# EAGLE board RFboardLeiden48_V_1.00 (EAGLE 7.7.0), part 1 of 2
AUTHOR: Kirchschlager Raimund
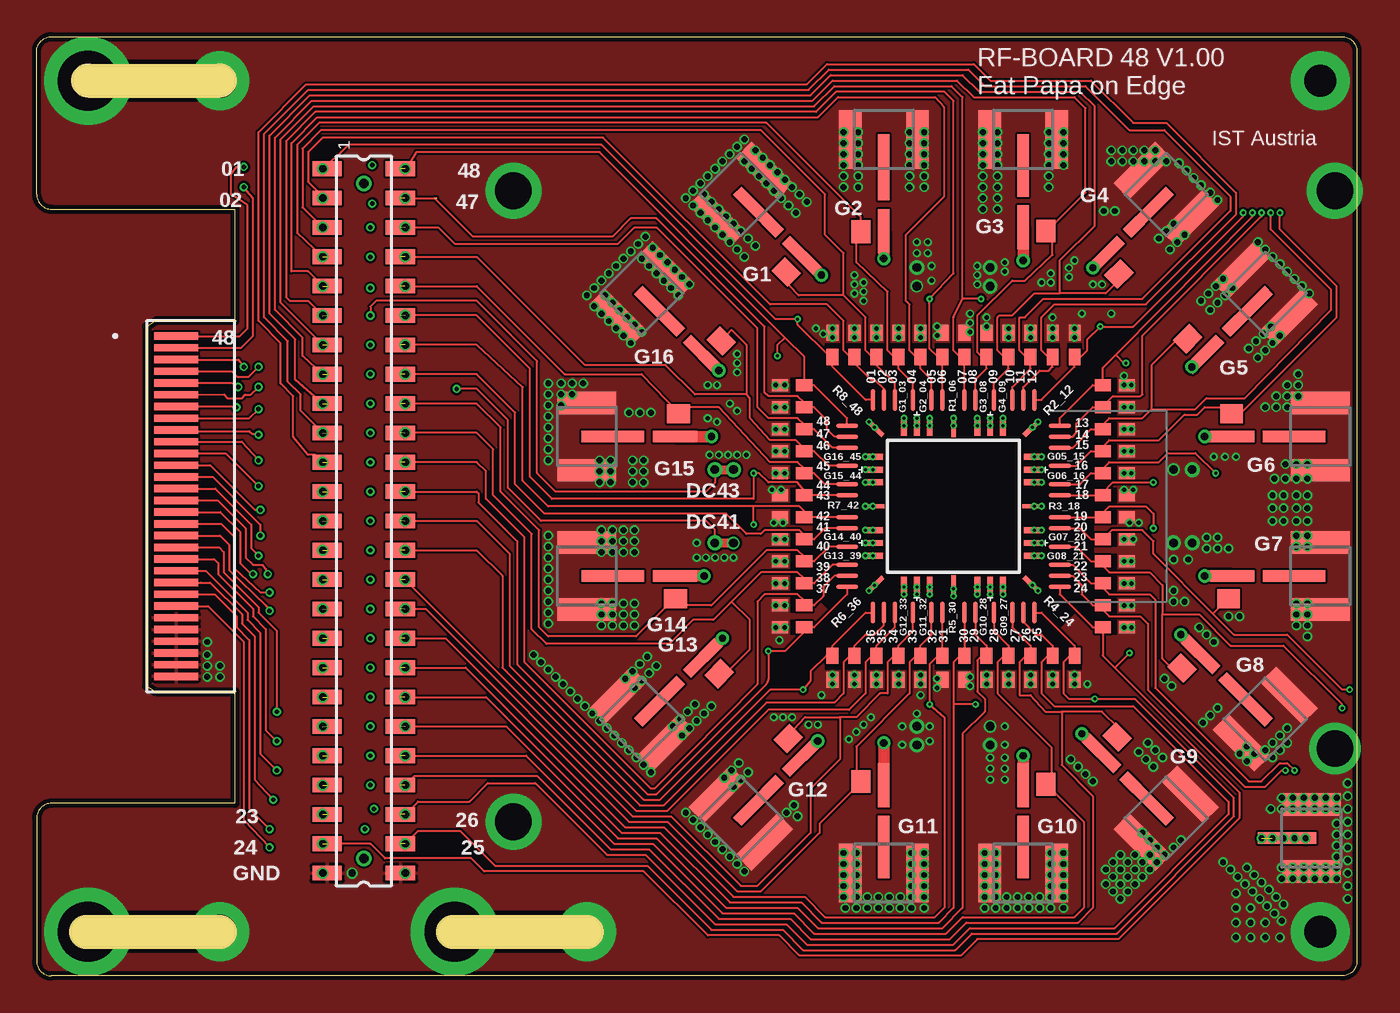
[diagram p5: board, top side]
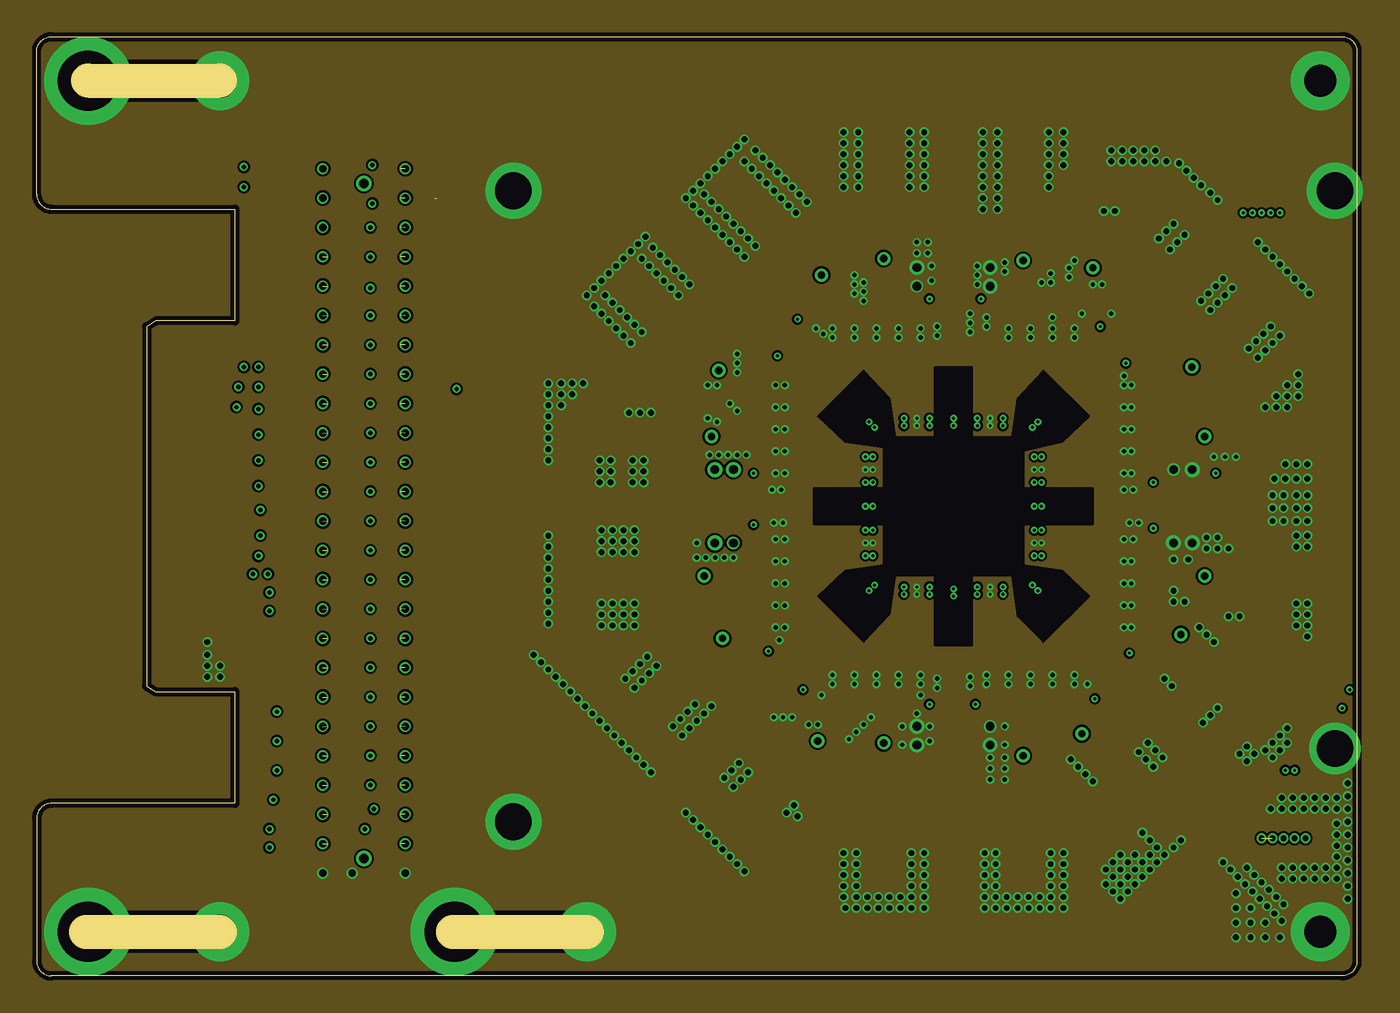
[diagram p6: board, inner layer GND1]
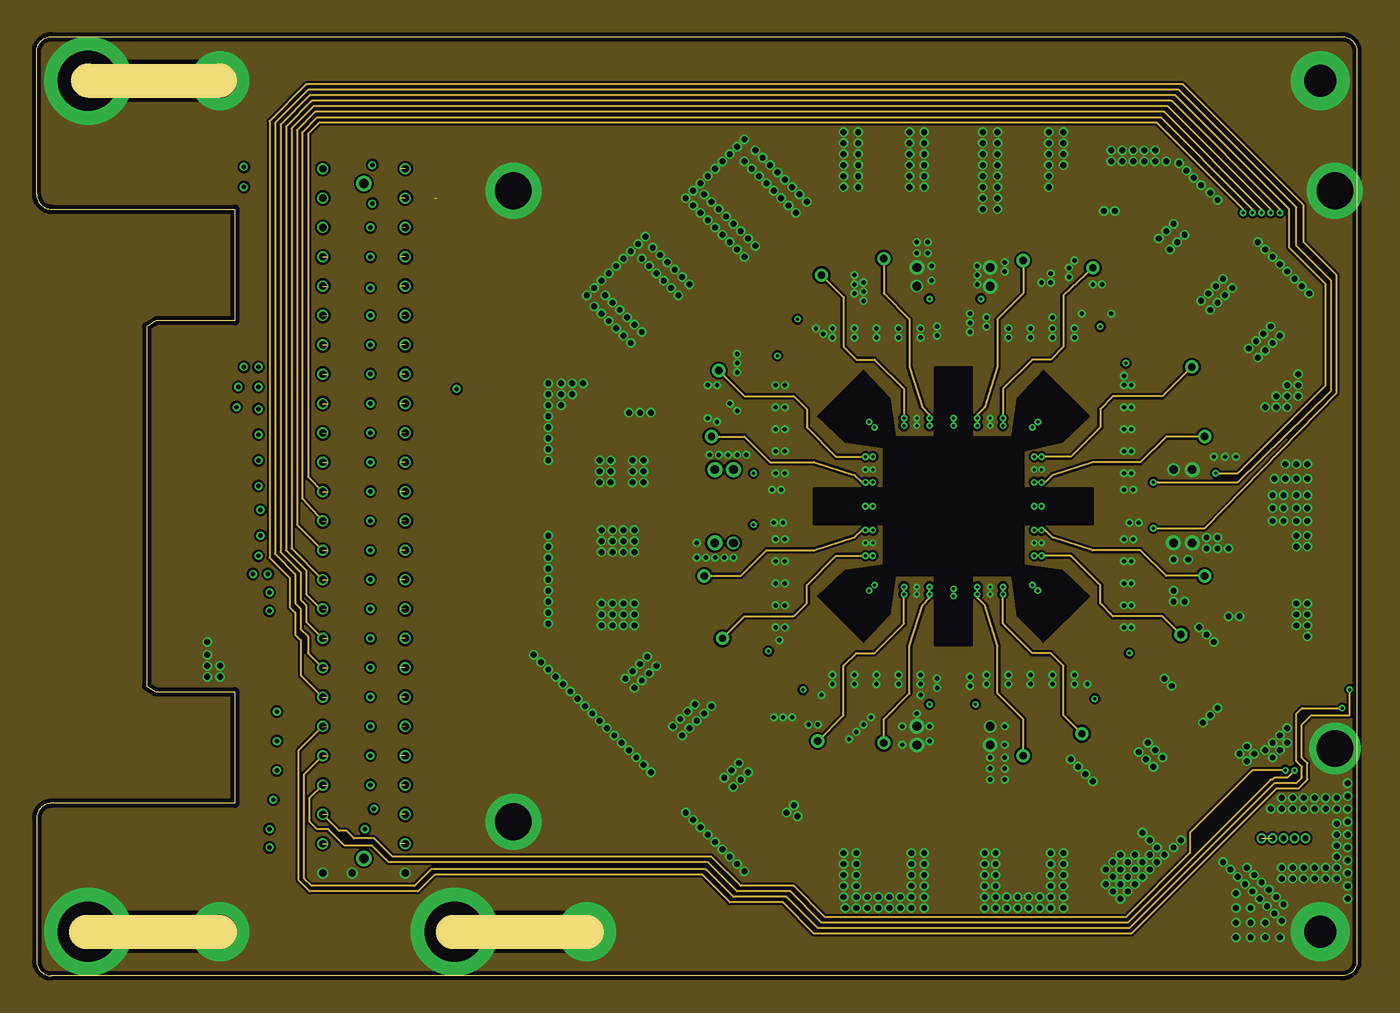
[diagram p7: board, inner layer FAST_GATES]
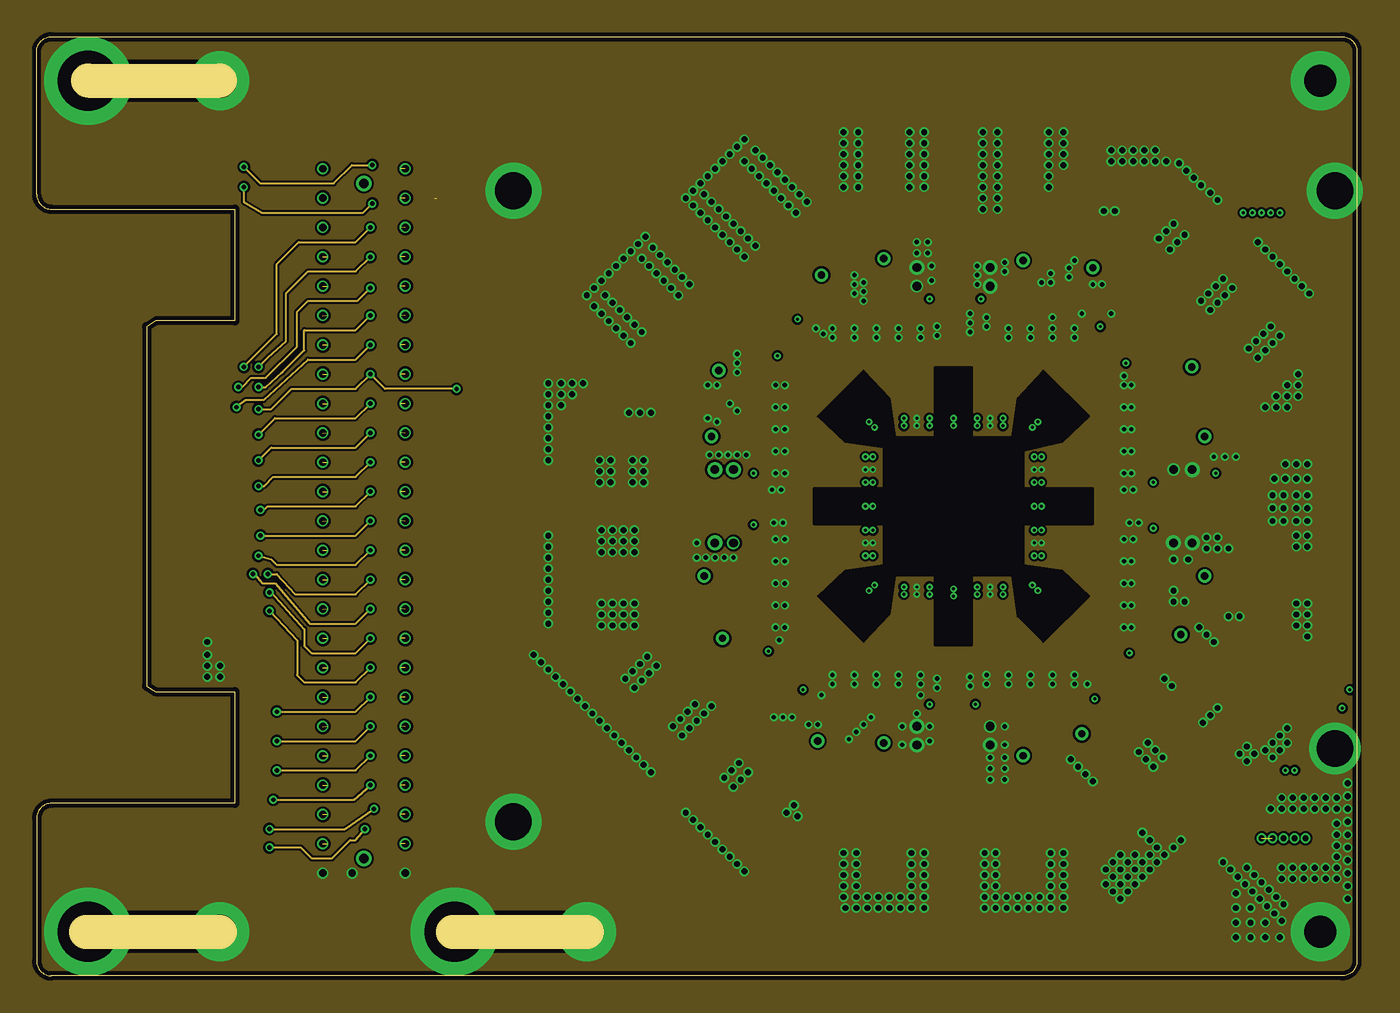
[diagram p8: board, inner layer GND2]
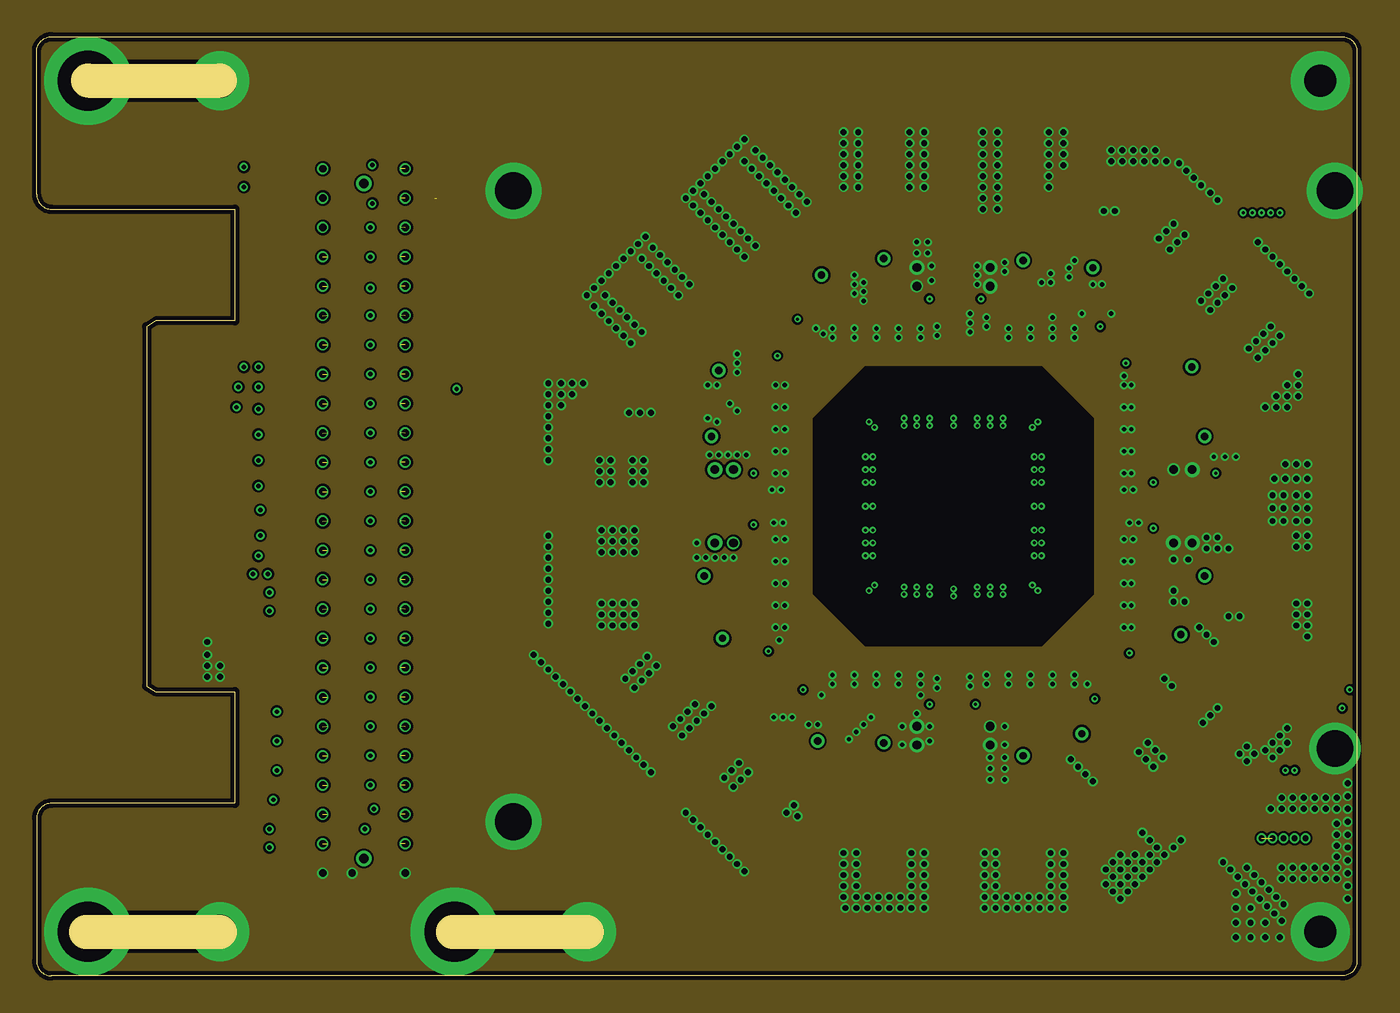
[diagram p9: board, inner layer GND_REFLECTOMETRY]
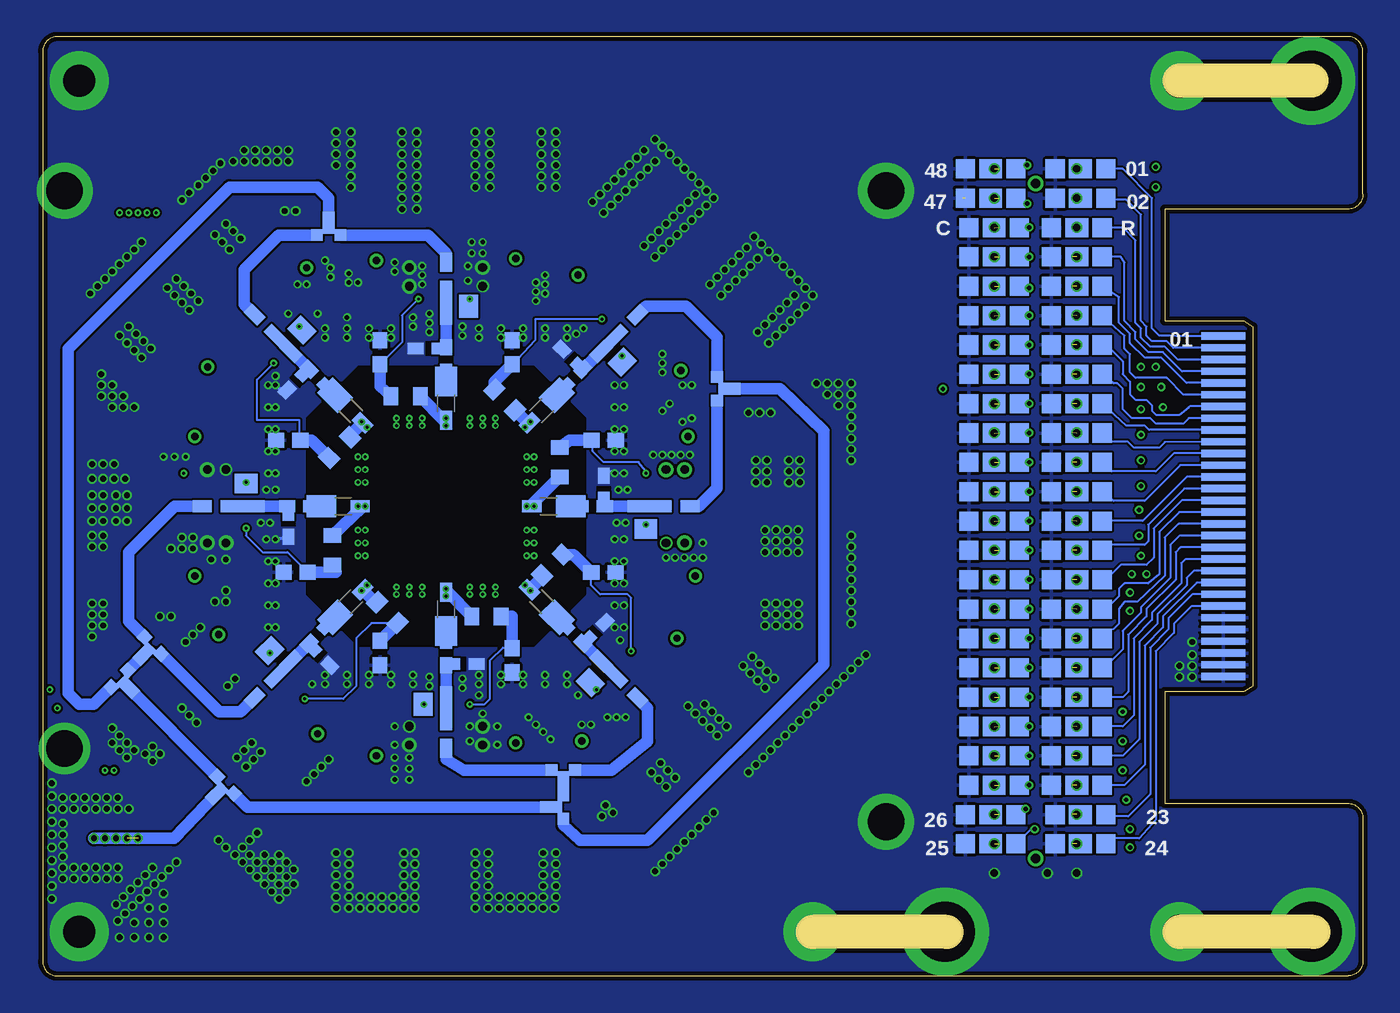
[diagram p10: board, bottom side, seen from below]

Size 90 x 64 mm. Coordinates in mm from the lower left corner, seen from the top.
Outline: 3.38,3 12.5,3
Outline: 3.5,61 12.5,61
Outline: 28.38,3 37.5,3
Outline: 0,53.25 0,63 arc-90 1,64 89,64 arc-90 90,63 90,1 arc-90 89,0 1,0 arc-90 0,1 0,10.75 arc-90 1,11.75 13.5,11.75 13.5,19.38 8.12,19.38 7.5,19.75 7.5,44.25 8.12,44.62 13.5,44.62 13.5,52.25 1,52.25 arc-90 0,53.25
Copper layers (1+2+3*14+15+16): TOP 0.035mm / dielectric 0.4mm / GND1 0.035mm / dielectric 0.2mm / FAST_GATES 0.035mm / dielectric 0.2mm / GND2 0.035mm / dielectric 0.2mm / GND_REFLECTOMETRY 0.035mm / dielectric 0.4mm / REFLECTOMETRY 0.035mm
Design rules "PCB-POOL HighSpec_ML6+ *": minimum track width 0.125mm, minimum drill 0.2mm, track to track 0.125mm, track to pad 0.125mm, pad to pad 0.125mm, via to via 0.125mm, smd to smd 0.125mm, copper to edge 0.3mm, drill to drill 0.2mm, minimum pad ring 0.2mm, minimum via ring 0.125mm, stop-mask expansion 0.065mm, vias tented up to drill 0.4mm, thermal gap 0.2mm
Net classes: 0 GND: clearance 0.15 mm; 1 HF: width 0.15 mm, clearance 0.25 mm; 2 REFL: width 0.8 mm, clearance 0.8 mm

## Footprints (pad centres in the part's own frame; a part is rotated, then mirrored left to right if it is on the bottom)
BIAS_TEE_UP_0603 = smd 1.3 x 0.8: HF 3.25,0 | smd 1.55 x 1.3: LF 0.25,-1.55 | smd 3 x 0.8: OUT 0.5,0
BIAS_TEE_DOWN_0603 = smd 1.3 x 0.8: HF 3.25,0 | smd 1.55 x 1.3: LF 0.45,1.55 | smd 3 x 0.8: OUT 0.5,0
SAMTEC_MEC8-130-XX-XX-D-CARD = smd 0.5 x 3: 1 -11.6,0; 3 -10.8,0; 5 -10,0; 7 -9.2,0; 9 -8.4,0; 11 -7.6,0; 13 -6.8,0; 15 -6,0; 17 -5.2,0; 19 -4.4,0; 21 -3.6,0; 23 -2.8,0; 25 -2,0; 27 -1.2,0; 29 -0.4,0; 31 0.4,0; 33 1.2,0; 35 2,0; 37 2.8,0; 39 3.6,0; 41 4.4,0; 43 5.2,0; 45 6,0; 47 6.8,0; 49 7.6,0; 51 8.4,0; 53 9.2,0; 55 10,0; 57 10.8,0; 59 11.6,0 | smd 0.5 x 3 bottom: 2 -11.6,0; 4 -10.8,0; 6 -10,0; 8 -9.2,0; 10 -8.4,0; 12 -7.6,0; 14 -6.8,0; 16 -6,0; 18 -5.2,0; 20 -4.4,0; 22 -3.6,0; 24 -2.8,0; 26 -2,0; 28 -1.2,0; 30 -0.4,0; 32 0.4,0; 34 1.2,0; 36 2,0; 38 2.8,0; 40 3.6,0; 42 4.4,0; 44 5.2,0; 46 6,0; 48 6.8,0; 50 7.6,0; 52 8.4,0; 54 9.2,0; 56 10,0; 58 10.8,0; 60 11.6,0
L_MATCH = smd 2 x 1.5: IN 1.5,0 | smd 1.3 x 0.8: OUT -1.15,0
LP-FILTER/1_STAGE/OS/0603_TOP = smd 1.3 x 1.3: $1 -1.6,0.01; $6 1.85,0.01 | smd 1.55 x 1.3: $4 0.125,0.01
SMP_STRAIGHT_MINI_WIDE = smd 0.8 x 4: 1 0,1.653 | smd 1.524 x 4: 2@1 -2.292,0; 2@2 2.292,0
48DC+24RF_V3.0 = smd 0.3 x 1.5: DC§1 -5.5,7.25; DC§2 -4.75,7.25; DC§3 -4,7.25; DC§4 -2.75,7.25; DC§5 -1.5,7.25; DC§6 -0.75,7.25; DC§7 0.75,7.25; DC§8 1.5,7.25; DC§9 2.75,7.25; DC§10 4,7.25; DC§11 4.75,7.25; DC§12 5.5,7.25; DC§25 5.5,-7.25; DC§26 4.75,-7.25; DC§27 4,-7.25; DC§28 2.75,-7.25; DC§29 1.5,-7.25; DC§30 0.75,-7.25; DC§31 -0.75,-7.25; DC§32 -1.5,-7.25; DC§33 -2.75,-7.25; DC§34 -4,-7.25; DC§35 -4.75,-7.25; DC§36 -5.5,-7.25; RF$06_R1 0,5.45; RF$30_R5 0,-5.45 | smd 1.5 x 0.3: DC§13 7.25,5.5; DC§14 7.25,4.75; DC§15 7.25,4; DC§16 7.25,2.75; DC§17 7.25,1.5; DC§18 7.25,0.75; DC§19 7.25,-0.75; DC§20 7.25,-1.5; DC§21 7.25,-2.75; DC§22 7.25,-4; DC§23 7.25,-4.75; DC§24 7.25,-5.5; DC§37 -7.25,-5.5; DC§38 -7.25,-4.75; DC§39 -7.25,-4; DC§40 -7.25,-2.75; DC§41 -7.25,-1.5; DC§42 -7.25,-0.75; DC§43 -7.25,0.75; DC§44 -7.25,1.5; DC§45 -7.25,2.75; DC§46 -7.25,4; DC§47 -7.25,4.75; DC§48 -7.25,5.5; RF$18_R3 5.45,0; RF$42_R7 -5.45,0 | smd 0.4 x 1.27: RF$03_G1 -3.375,5.45; RF$04_G2 -1.625,5.45; RF$08_G3 1.625,5.45; RF$09_G4 3.375,5.45; RF$27_G9 3.375,-5.45; RF$28_G10 1.625,-5.45; RF$32_G11 -1.625,-5.45; RF$33_G12 -3.375,-5.45; RF$GND -2.5,5.45; RF$GND1 2.5,5.45; RF$GND4 2.5,-5.45; RF$GND5 -2.5,-5.45 | smd 1.5 x 0.3 rotated 45: RF$12_R2 5.35,5.35; RF$36_R6 -5.35,-5.35 | smd 1.27 x 0.4: RF$15_G5 5.45,3.375; RF$16_G6 5.45,1.625; RF$20_G7 5.45,-1.625; RF$21_G8 5.45,-3.375; RF$39_G13 -5.45,-3.375; RF$40_G14 -5.45,-1.625; RF$44_G15 -5.45,1.625; RF$45_G16 -5.45,3.375; RF$GND2 5.45,2.5; RF$GND3 5.45,-2.5; RF$GND6 -5.45,-2.5; RF$GND7 -5.45,2.5 | smd 1.5 x 0.3 rotated 135: RF$24_R4 5.35,-5.35; RF$48_R8 -5.35,5.35
T_JUNCTION_0.3MM = smd 0.8 x 1.5 bottom: P$1 0,-0.81 | smd 0.8 x 0.8 bottom: P$2 -0.8,0.02; P$3 0.8,0.02 | smd 1 x 0.32 bottom: P$4 0,-0.22
LP-FILTER/CAPACITOR/0603_BOTTOM = smd 1.1 x 0.8 bottom: IN -0.825,0; OUT 0.825,0
LP-FILTER/VARACTOR_V2 = smd 1 x 1.2 bottom: OUT 1,0; OUT1 -1,0
LP-FILTER/CAPACITOR/0603_BOTTOM_V2 = smd 1.1 x 1 bottom: IN -0.825,0; OUT 0.825,0
SMDSMALL87758-5016 = drill 0.65: MOUNT1 -23,0; MOUNT2 23,0 | smd 1 x 2: P$1 -24,-2.5; P$2 -24,2.5; P$3 -22,-2.5; P$4 -22,2.5; P$5 -20,-2.5; P$6 -20,2.5; P$7 -18,-2.5; P$8 -18,2.5; P$9 -16,-2.5; P$10 -16,2.5; P$11 -14,-2.5; P$12 -14,2.5; P$13 -12,-2.5; P$14 -12,2.5; P$15 -10,-2.5; P$16 -10,2.5; P$17 -8,-2.5; P$18 -8,2.5; P$19 -6,-2.5; P$20 -6,2.5; P$21 -4,-2.5; P$22 -4,2.5; P$23 -2,-2.5; P$24 -2,2.5; P$25 0,-2.5; P$26 0,2.5; P$27 2,-2.5; P$28 2,2.5; P$29 4,-2.5; P$30 4,2.5; P$31 6,-2.5; P$32 6,2.5; P$33 8,-2.5; P$34 8,2.5; P$35 10,-2.5; P$36 10,2.5; P$37 12,-2.5; P$38 12,2.5; P$39 14,-2.5; P$40 14,2.5; P$41 16,-2.5; P$42 16,2.5; P$43 18,-2.5; P$44 18,2.5; P$45 20,-2.5; P$46 20,2.5; P$47 22,-2.5; P$48 22,2.5; P$49 24,-2.5; P$50 24,2.5

## Placement (x,y rotation side)
B$1  BIASTEEUP1  [BIAS_TEE_UP_0603]  51.75,42.75 45 bottom
B$2  BIASTEEUP1  [BIAS_TEE_UP_0603]  62.5,45.38 90 bottom
B$3  BIASTEEUP1  [BIAS_TEE_UP_0603]  73.25,42.75 135 bottom
B$4  BIASTEEUP1  [BIAS_TEE_UP_0603]  75.88,32 180 bottom
B$5  BIASTEEUP1  [BIAS_TEE_UP_0603]  73.25,21.25 225 bottom
B$6  BIASTEEDOWN1  [BIAS_TEE_DOWN_0603]  52.5,48.75 135 top
B$7  BIASTEEUP1  [BIAS_TEE_UP_0603]  49.12,32 0 bottom
B$8  BIASTEEUP1  [BIAS_TEE_UP_0603]  62.5,18.75 270 bottom
B$9  BIASTEEUP1  [BIAS_TEE_UP_0603]  51.75,21.25 315 bottom
B$10  BIASTEEDOWN1  [BIAS_TEE_DOWN_0603]  72.25,15.5 315 top
B$11  BIASTEEDOWN1  [BIAS_TEE_DOWN_0603]  57.75,50.25 90 top
B$12  BIASTEEUP1  [BIAS_TEE_UP_0603]  67.25,50.5 90 top
B$13  BIASTEEUP1  [BIAS_TEE_UP_0603]  72.5,48.75 45 top
B$14  BIASTEEDOWN1  [BIAS_TEE_DOWN_0603]  79.25,42 45 top
B$15  BIASTEEDOWN1  [BIAS_TEE_DOWN_0603]  81,36.75 0 top
B$16  BIASTEEUP1  [BIAS_TEE_UP_0603]  81,27.25 0 top
B$17  BIASTEEUP1  [BIAS_TEE_UP_0603]  79,22.25 315 top
B$18  BIASTEEDOWN1  [BIAS_TEE_DOWN_0603]  67.25,13.5 270 top
B$19  BIASTEEUP1  [BIAS_TEE_UP_0603]  57.75,13.5 270 top
B$20  BIASTEEUP1  [BIAS_TEE_UP_0603]  52.5,15.25 225 top
B$21  BIASTEEDOWN1  [BIAS_TEE_DOWN_0603]  45.75,22 225 top
B$22  BIASTEEDOWN1  [BIAS_TEE_DOWN_0603]  44,27.25 180 top
B$23  BIASTEEUP1  [BIAS_TEE_UP_0603]  44,36.75 180 top
B$24  BIASTEEUP1  [BIAS_TEE_UP_0603]  45.75,42 135 top
J1  MEC8-130-XX-XX-D-CARD  [SAMTEC_MEC8-130-XX-XX-D-CARD]  9.5,32 270 top
L$1  L_MATCH  [L_MATCH]  55.5,32 0 bottom
L$2  L_MATCH  [L_MATCH]  56,38.5 45 bottom
L$3  L_MATCH  [L_MATCH]  62.5,39 90 bottom
L$4  L_MATCH  [L_MATCH]  69,38.5 135 bottom
L$5  L_MATCH  [L_MATCH]  69.5,32 180 bottom
L$6  L_MATCH  [L_MATCH]  69,25.5 225 bottom
L$7  L_MATCH  [L_MATCH]  62.5,25 270 bottom
L$8  L_MATCH  [L_MATCH]  56,25.5 315 bottom
LP$1  LP-FILTER/1-STAGETOP  [LP-FILTER/1_STAGE/OS/0603_TOP]  19.12,55 180 bottom
LP$2  LP-FILTER/1-STAGETOP  [LP-FILTER/1_STAGE/OS/0603_TOP]  19.12,53 180 bottom
LP$3  LP-FILTER/1-STAGETOP  [LP-FILTER/1_STAGE/OS/0603_TOP]  19.38,51 180 bottom
LP$4  LP-FILTER/1-STAGETOP  [LP-FILTER/1_STAGE/OS/0603_TOP]  19.38,49 180 bottom
LP$5  LP-FILTER/1-STAGETOP  [LP-FILTER/1_STAGE/OS/0603_TOP]  19.38,47 180 bottom
LP$6  LP-FILTER/1-STAGETOP  [LP-FILTER/1_STAGE/OS/0603_TOP]  19.38,45 180 bottom
LP$7  LP-FILTER/1-STAGETOP  [LP-FILTER/1_STAGE/OS/0603_TOP]  19.38,43 180 bottom
LP$8  LP-FILTER/1-STAGETOP  [LP-FILTER/1_STAGE/OS/0603_TOP]  19.38,41 180 bottom
LP$9  LP-FILTER/1-STAGETOP  [LP-FILTER/1_STAGE/OS/0603_TOP]  19.38,39 180 bottom
LP$10  LP-FILTER/1-STAGETOP  [LP-FILTER/1_STAGE/OS/0603_TOP]  19.38,37 180 bottom
LP$11  LP-FILTER/1-STAGETOP  [LP-FILTER/1_STAGE/OS/0603_TOP]  19.38,35 180 bottom
LP$12  LP-FILTER/1-STAGETOP  [LP-FILTER/1_STAGE/OS/0603_TOP]  19.38,33 180 bottom
LP$13  LP-FILTER/1-STAGETOP  [LP-FILTER/1_STAGE/OS/0603_TOP]  19.38,31 180 bottom
LP$14  LP-FILTER/1-STAGETOP  [LP-FILTER/1_STAGE/OS/0603_TOP]  19.38,29 180 bottom
LP$15  LP-FILTER/1-STAGETOP  [LP-FILTER/1_STAGE/OS/0603_TOP]  19.38,27 180 bottom
LP$16  LP-FILTER/1-STAGETOP  [LP-FILTER/1_STAGE/OS/0603_TOP]  19.38,25 180 bottom
LP$17  LP-FILTER/1-STAGETOP  [LP-FILTER/1_STAGE/OS/0603_TOP]  19.38,23 180 bottom
LP$18  LP-FILTER/1-STAGETOP  [LP-FILTER/1_STAGE/OS/0603_TOP]  19.38,21 180 bottom
LP$19  LP-FILTER/1-STAGETOP  [LP-FILTER/1_STAGE/OS/0603_TOP]  19.38,19 180 bottom
LP$20  LP-FILTER/1-STAGETOP  [LP-FILTER/1_STAGE/OS/0603_TOP]  19.38,17 180 bottom
LP$21  LP-FILTER/1-STAGETOP  [LP-FILTER/1_STAGE/OS/0603_TOP]  19.38,15 180 bottom
LP$22  LP-FILTER/1-STAGETOP  [LP-FILTER/1_STAGE/OS/0603_TOP]  19.38,13 180 bottom
LP$23  LP-FILTER/1-STAGETOP  [LP-FILTER/1_STAGE/OS/0603_TOP]  19.12,11 180 bottom
LP$24  LP-FILTER/1-STAGETOP  [LP-FILTER/1_STAGE/OS/0603_TOP]  19.12,9 180 bottom
LP$25  LP-FILTER/1-STAGETOP  [LP-FILTER/1_STAGE/OS/0603_TOP]  25.25,9 180 bottom
LP$26  LP-FILTER/1-STAGETOP  [LP-FILTER/1_STAGE/OS/0603_TOP]  25.25,11 180 bottom
LP$27  LP-FILTER/1-STAGETOP  [LP-FILTER/1_STAGE/OS/0603_TOP]  25,13 180 bottom
LP$28  LP-FILTER/1-STAGETOP  [LP-FILTER/1_STAGE/OS/0603_TOP]  25,15 180 bottom
LP$29  LP-FILTER/1-STAGETOP  [LP-FILTER/1_STAGE/OS/0603_TOP]  25,17 180 bottom
LP$30  LP-FILTER/1-STAGETOP  [LP-FILTER/1_STAGE/OS/0603_TOP]  25,19 180 bottom
LP$31  LP-FILTER/1-STAGETOP  [LP-FILTER/1_STAGE/OS/0603_TOP]  25,21 180 bottom
LP$32  LP-FILTER/1-STAGETOP  [LP-FILTER/1_STAGE/OS/0603_TOP]  25,23 180 bottom
LP$33  LP-FILTER/1-STAGETOP  [LP-FILTER/1_STAGE/OS/0603_TOP]  25,25 180 bottom
LP$34  LP-FILTER/1-STAGETOP  [LP-FILTER/1_STAGE/OS/0603_TOP]  25,27 180 bottom
LP$35  LP-FILTER/1-STAGETOP  [LP-FILTER/1_STAGE/OS/0603_TOP]  25,29 180 bottom
LP$36  LP-FILTER/1-STAGETOP  [LP-FILTER/1_STAGE/OS/0603_TOP]  25,31 180 bottom
LP$37  LP-FILTER/1-STAGETOP  [LP-FILTER/1_STAGE/OS/0603_TOP]  25,33 180 bottom
LP$38  LP-FILTER/1-STAGETOP  [LP-FILTER/1_STAGE/OS/0603_TOP]  25,35 180 bottom
LP$39  LP-FILTER/1-STAGETOP  [LP-FILTER/1_STAGE/OS/0603_TOP]  25,37 180 bottom
LP$40  LP-FILTER/1-STAGETOP  [LP-FILTER/1_STAGE/OS/0603_TOP]  25,39 180 bottom
LP$41  LP-FILTER/1-STAGETOP  [LP-FILTER/1_STAGE/OS/0603_TOP]  25,41 180 bottom
LP$42  LP-FILTER/1-STAGETOP  [LP-FILTER/1_STAGE/OS/0603_TOP]  25,43 180 bottom
LP$43  LP-FILTER/1-STAGETOP  [LP-FILTER/1_STAGE/OS/0603_TOP]  25,45 180 bottom
LP$44  LP-FILTER/1-STAGETOP  [LP-FILTER/1_STAGE/OS/0603_TOP]  25,47 180 bottom
LP$45  LP-FILTER/1-STAGETOP  [LP-FILTER/1_STAGE/OS/0603_TOP]  25,49 180 bottom
LP$46  LP-FILTER/1-STAGETOP  [LP-FILTER/1_STAGE/OS/0603_TOP]  25,51 180 bottom
LP$47  LP-FILTER/1-STAGETOP  [LP-FILTER/1_STAGE/OS/0603_TOP]  25.25,53 180 bottom
LP$48  LP-FILTER/1-STAGETOP  [LP-FILTER/1_STAGE/OS/0603_TOP]  25.25,55 180 bottom
S$1  MC-921WIDE  [SMP_STRAIGHT_MINI_WIDE]  48,53.25 225 top
S$2  MC-921WIDE  [SMP_STRAIGHT_MINI_WIDE]  77,10.75 45 top
S$3  MC-921WIDE  [SMP_STRAIGHT_MINI_WIDE]  67.25,7 0 top
S$4  MC-921WIDE  [SMP_STRAIGHT_MINI_WIDE]  57.75,7 0 top
S$5  MC-921WIDE  [SMP_STRAIGHT_MINI_WIDE]  86.9,9.39 90 top
S$6  MC-921WIDE  [SMP_STRAIGHT_MINI_WIDE]  48,10.75 315 top
S$7  MC-921WIDE  [SMP_STRAIGHT_MINI_WIDE]  41.25,17.5 315 top
S$8  MC-921WIDE  [SMP_STRAIGHT_MINI_WIDE]  57.75,57 180 top
S$9  MC-921WIDE  [SMP_STRAIGHT_MINI_WIDE]  67.25,57 180 top
S$10  MC-921WIDE  [SMP_STRAIGHT_MINI_WIDE]  77,53.25 135 top
S$11  MC-921WIDE  [SMP_STRAIGHT_MINI_WIDE]  83.75,46.5 135 top
S$12  MC-921WIDE  [SMP_STRAIGHT_MINI_WIDE]  87.5,36.75 90 top
S$13  MC-921WIDE  [SMP_STRAIGHT_MINI_WIDE]  87.5,27.25 90 top
S$14  MC-921WIDE  [SMP_STRAIGHT_MINI_WIDE]  83.75,17.5 45 top
S$15  MC-921WIDE  [SMP_STRAIGHT_MINI_WIDE]  37.5,27.25 270 top
S$16  MC-921WIDE  [SMP_STRAIGHT_MINI_WIDE]  37.5,36.75 270 top
S$17  MC-921WIDE  [SMP_STRAIGHT_MINI_WIDE]  41.25,46.5 225 top
U$1  48DC+24RF_V3.0  [48DC+24RF_V3.0]  62.5,32 0 top
U$2  TJUNCTION  [T_JUNCTION_0.3MM]  44,40 270 top
U$3  TJUNCTION  [T_JUNCTION_0.3MM]  54.52,11.5 90 top
U$4  TJUNCTION  [T_JUNCTION_0.3MM]  77.55,12.99 45 top
U$5  TJUNCTION  [T_JUNCTION_0.3MM]  84.73,20.23 315 top
U$6  TJUNCTION  [T_JUNCTION_0.3MM]  70.5,50.5 180 top
U$7  LP-FILTER/CAPACITOR/0603THIN  [LP-FILTER/CAPACITOR/0603_BOTTOM]  51.75,33.25 90 top
U$8  TJUNCTION  [T_JUNCTION_0.3MM]  82.5,22.5 45 top
U$9  TJUNCTION  [T_JUNCTION_0.3MM]  54.5,14 0 top
U$10  LP-FILTER/CAPACITOR/0603THIN  [LP-FILTER/CAPACITOR/0603_BOTTOM]  54,42.12 45 top
U$11  LP-FILTER/VARACTOR_V2  [LP-FILTER/VARACTOR_V2]  58.5,39.25 225 top
U$12  LP-FILTER/CAPACITOR/0603NORMAL  [LP-FILTER/CAPACITOR/0603_BOTTOM_V2]  58,42.5 270 top
U$13  LP-FILTER/CAPACITOR/0603THIN  [LP-FILTER/CAPACITOR/0603_BOTTOM]  53.75,40.75 135 top
U$14  LP-FILTER/VARACTOR_V2  [LP-FILTER/VARACTOR_V2]  54.75,35 270 top
U$15  LP-FILTER/CAPACITOR/0603NORMAL  [LP-FILTER/CAPACITOR/0603_BOTTOM_V2]  51.75,36.5 0 top
U$16  LP-FILTER/CAPACITOR/0603THIN  [LP-FILTER/CAPACITOR/0603_BOTTOM]  63.75,42.75 0 top
U$17  LP-FILTER/CAPACITOR/0603THIN  [LP-FILTER/CAPACITOR/0603_BOTTOM]  52.5,32 180 top
U$18  LP-FILTER/VARACTOR_V2  [LP-FILTER/VARACTOR_V2]  65.25,39.5 180 top
U$19  LP-FILTER/CAPACITOR/0603NORMAL  [LP-FILTER/CAPACITOR/0603_BOTTOM_V2]  67,42.5 270 top
U$20  LP-FILTER/CAPACITOR/0603THIN  [LP-FILTER/CAPACITOR/0603_BOTTOM]  62.5,42 90 top
U$21  LP-FILTER/CAPACITOR/0603THIN  [LP-FILTER/CAPACITOR/0603_BOTTOM]  73.25,30.75 270 top
U$22  LP-FILTER/CAPACITOR/0603THIN  [LP-FILTER/CAPACITOR/0603_BOTTOM]  72.75,40.5 315 top
U$23  LP-FILTER/VARACTOR_V2  [LP-FILTER/VARACTOR_V2]  69.75,36 135 top
U$24  LP-FILTER/CAPACITOR/0603NORMAL  [LP-FILTER/CAPACITOR/0603_BOTTOM_V2]  73.25,36.5 180 top
U$26  LP-FILTER/CAPACITOR/0603THIN  [LP-FILTER/CAPACITOR/0603_BOTTOM]  71.25,40.75 45 top
U$27  LP-FILTER/VARACTOR_V2  [LP-FILTER/VARACTOR_V2]  70.25,29 90 top
U$28  LP-FILTER/CAPACITOR/0603NORMAL  [LP-FILTER/CAPACITOR/0603_BOTTOM_V2]  72.75,27.5 180 top
U$29  LP-FILTER/CAPACITOR/0603THIN  [LP-FILTER/CAPACITOR/0603_BOTTOM]  72.5,32 0 top
U$30  LP-FILTER/CAPACITOR/0603THIN  [LP-FILTER/CAPACITOR/0603_BOTTOM]  71,21.75 225 top
U$31  LP-FILTER/VARACTOR_V2  [LP-FILTER/VARACTOR_V2]  66.5,24.75 45 top
U$32  LP-FILTER/CAPACITOR/0603NORMAL  [LP-FILTER/CAPACITOR/0603_BOTTOM_V2]  67,22 90 top
U$33  LP-FILTER/CAPACITOR/0603THIN  [LP-FILTER/CAPACITOR/0603_BOTTOM]  71.25,23.25 315 top
U$34  LP-FILTER/CAPACITOR/0603THIN  [LP-FILTER/CAPACITOR/0603_BOTTOM]  61.25,21.25 180 top
U$35  LP-FILTER/VARACTOR_V2  [LP-FILTER/VARACTOR_V2]  59.75,24.5 0 top
U$36  LP-FILTER/CAPACITOR/0603NORMAL  [LP-FILTER/CAPACITOR/0603_BOTTOM_V2]  58,21.5 90 top
U$37  LP-FILTER/CAPACITOR/0603THIN  [LP-FILTER/CAPACITOR/0603_BOTTOM]  62.5,22 270 top
U$38  LP-FILTER/CAPACITOR/0603THIN  [LP-FILTER/CAPACITOR/0603_BOTTOM]  52.25,23.5 135 top
U$39  LP-FILTER/VARACTOR_V2  [LP-FILTER/VARACTOR_V2]  55.25,28 315 top
U$40  LP-FILTER/CAPACITOR/0603NORMAL  [LP-FILTER/CAPACITOR/0603_BOTTOM_V2]  51.77,27.49 0 top
U$41  LP-FILTER/CAPACITOR/0603THIN  [LP-FILTER/CAPACITOR/0603_BOTTOM]  53.75,23.25 225 top
U$42  LP-FILTER/CAPACITOR/0603THIN  [LP-FILTER/CAPACITOR/0603_BOTTOM]  54.25,43 270 bottom
U$43  LP-FILTER/CAPACITOR/0603THIN  [LP-FILTER/CAPACITOR/0603_BOTTOM]  55.75,43 270 bottom
U$44  LP-FILTER/CAPACITOR/0603THIN  [LP-FILTER/CAPACITOR/0603_BOTTOM]  57.25,43 270 bottom
U$45  LP-FILTER/CAPACITOR/0603THIN  [LP-FILTER/CAPACITOR/0603_BOTTOM]  58.75,43 270 bottom
U$46  LP-FILTER/CAPACITOR/0603THIN  [LP-FILTER/CAPACITOR/0603_BOTTOM]  60.25,43 270 bottom
U$47  LP-FILTER/CAPACITOR/0603THIN  [LP-FILTER/CAPACITOR/0603_BOTTOM]  61.75,43 270 bottom
U$48  LP-FILTER/CAPACITOR/0603THIN  [LP-FILTER/CAPACITOR/0603_BOTTOM]  63.25,43 270 bottom
U$49  LP-FILTER/CAPACITOR/0603THIN  [LP-FILTER/CAPACITOR/0603_BOTTOM]  64.75,43 270 bottom
U$50  LP-FILTER/CAPACITOR/0603THIN  [LP-FILTER/CAPACITOR/0603_BOTTOM]  66.25,43 270 bottom
U$51  LP-FILTER/CAPACITOR/0603THIN  [LP-FILTER/CAPACITOR/0603_BOTTOM]  67.75,43 270 bottom
U$52  LP-FILTER/CAPACITOR/0603THIN  [LP-FILTER/CAPACITOR/0603_BOTTOM]  69.25,43 270 bottom
U$53  LP-FILTER/CAPACITOR/0603THIN  [LP-FILTER/CAPACITOR/0603_BOTTOM]  70.75,43 270 bottom
U$54  LP-FILTER/CAPACITOR/0603THIN  [LP-FILTER/CAPACITOR/0603_BOTTOM]  73.5,40.25 180 bottom
U$55  LP-FILTER/CAPACITOR/0603THIN  [LP-FILTER/CAPACITOR/0603_BOTTOM]  73.5,38.75 180 bottom
U$56  LP-FILTER/CAPACITOR/0603THIN  [LP-FILTER/CAPACITOR/0603_BOTTOM]  73.5,37.25 180 bottom
U$57  LP-FILTER/CAPACITOR/0603THIN  [LP-FILTER/CAPACITOR/0603_BOTTOM]  73.5,35.75 180 bottom
U$58  LP-FILTER/CAPACITOR/0603THIN  [LP-FILTER/CAPACITOR/0603_BOTTOM]  73.5,34.25 180 bottom
U$59  LP-FILTER/CAPACITOR/0603THIN  [LP-FILTER/CAPACITOR/0603_BOTTOM]  73.5,32.75 180 bottom
U$60  LP-FILTER/CAPACITOR/0603THIN  [LP-FILTER/CAPACITOR/0603_BOTTOM]  73.5,31.25 180 bottom
U$61  LP-FILTER/CAPACITOR/0603THIN  [LP-FILTER/CAPACITOR/0603_BOTTOM]  73.5,29.75 180 bottom
U$62  LP-FILTER/CAPACITOR/0603THIN  [LP-FILTER/CAPACITOR/0603_BOTTOM]  73.5,28.25 180 bottom
U$63  LP-FILTER/CAPACITOR/0603THIN  [LP-FILTER/CAPACITOR/0603_BOTTOM]  73.5,26.75 180 bottom
U$64  LP-FILTER/CAPACITOR/0603THIN  [LP-FILTER/CAPACITOR/0603_BOTTOM]  73.5,25.25 180 bottom
U$65  LP-FILTER/CAPACITOR/0603THIN  [LP-FILTER/CAPACITOR/0603_BOTTOM]  73.5,23.75 180 bottom
U$66  LP-FILTER/CAPACITOR/0603THIN  [LP-FILTER/CAPACITOR/0603_BOTTOM]  70.75,21 270 bottom
U$67  LP-FILTER/CAPACITOR/0603THIN  [LP-FILTER/CAPACITOR/0603_BOTTOM]  69.25,21 270 bottom
U$68  LP-FILTER/CAPACITOR/0603THIN  [LP-FILTER/CAPACITOR/0603_BOTTOM]  67.75,21 270 bottom
U$69  LP-FILTER/CAPACITOR/0603THIN  [LP-FILTER/CAPACITOR/0603_BOTTOM]  66.25,21 270 bottom
U$70  LP-FILTER/CAPACITOR/0603THIN  [LP-FILTER/CAPACITOR/0603_BOTTOM]  64.75,21 270 bottom
U$71  LP-FILTER/CAPACITOR/0603THIN  [LP-FILTER/CAPACITOR/0603_BOTTOM]  63.25,21 270 bottom
U$72  LP-FILTER/CAPACITOR/0603THIN  [LP-FILTER/CAPACITOR/0603_BOTTOM]  61.75,21 270 bottom
U$73  LP-FILTER/CAPACITOR/0603THIN  [LP-FILTER/CAPACITOR/0603_BOTTOM]  60.25,21 270 bottom
U$74  LP-FILTER/CAPACITOR/0603THIN  [LP-FILTER/CAPACITOR/0603_BOTTOM]  58.75,21 270 bottom
U$75  LP-FILTER/CAPACITOR/0603THIN  [LP-FILTER/CAPACITOR/0603_BOTTOM]  57.25,21 270 bottom
U$76  LP-FILTER/CAPACITOR/0603THIN  [LP-FILTER/CAPACITOR/0603_BOTTOM]  55.75,21 270 bottom
U$77  LP-FILTER/CAPACITOR/0603THIN  [LP-FILTER/CAPACITOR/0603_BOTTOM]  54.25,21 270 bottom
U$78  LP-FILTER/CAPACITOR/0603THIN  [LP-FILTER/CAPACITOR/0603_BOTTOM]  51.5,23.75 0 bottom
U$79  LP-FILTER/CAPACITOR/0603THIN  [LP-FILTER/CAPACITOR/0603_BOTTOM]  51.5,25.25 0 bottom
U$80  LP-FILTER/CAPACITOR/0603THIN  [LP-FILTER/CAPACITOR/0603_BOTTOM]  51.5,26.75 0 bottom
U$81  LP-FILTER/CAPACITOR/0603THIN  [LP-FILTER/CAPACITOR/0603_BOTTOM]  51.5,28.25 0 bottom
U$82  LP-FILTER/CAPACITOR/0603THIN  [LP-FILTER/CAPACITOR/0603_BOTTOM]  51.5,29.75 0 bottom
U$83  LP-FILTER/CAPACITOR/0603THIN  [LP-FILTER/CAPACITOR/0603_BOTTOM]  51.5,31.25 0 bottom
U$84  LP-FILTER/CAPACITOR/0603THIN  [LP-FILTER/CAPACITOR/0603_BOTTOM]  51.5,32.75 0 bottom
U$85  LP-FILTER/CAPACITOR/0603THIN  [LP-FILTER/CAPACITOR/0603_BOTTOM]  51.5,34.25 0 bottom
U$86  LP-FILTER/CAPACITOR/0603THIN  [LP-FILTER/CAPACITOR/0603_BOTTOM]  51.5,35.75 0 bottom
U$87  LP-FILTER/CAPACITOR/0603THIN  [LP-FILTER/CAPACITOR/0603_BOTTOM]  51.5,37.25 0 bottom
U$88  LP-FILTER/CAPACITOR/0603THIN  [LP-FILTER/CAPACITOR/0603_BOTTOM]  51.5,38.75 0 bottom
U$89  LP-FILTER/CAPACITOR/0603THIN  [LP-FILTER/CAPACITOR/0603_BOTTOM]  51.5,40.25 0 bottom
X1  RS180-3958  [SMDSMALL87758-5016]  22.3,31 270 top